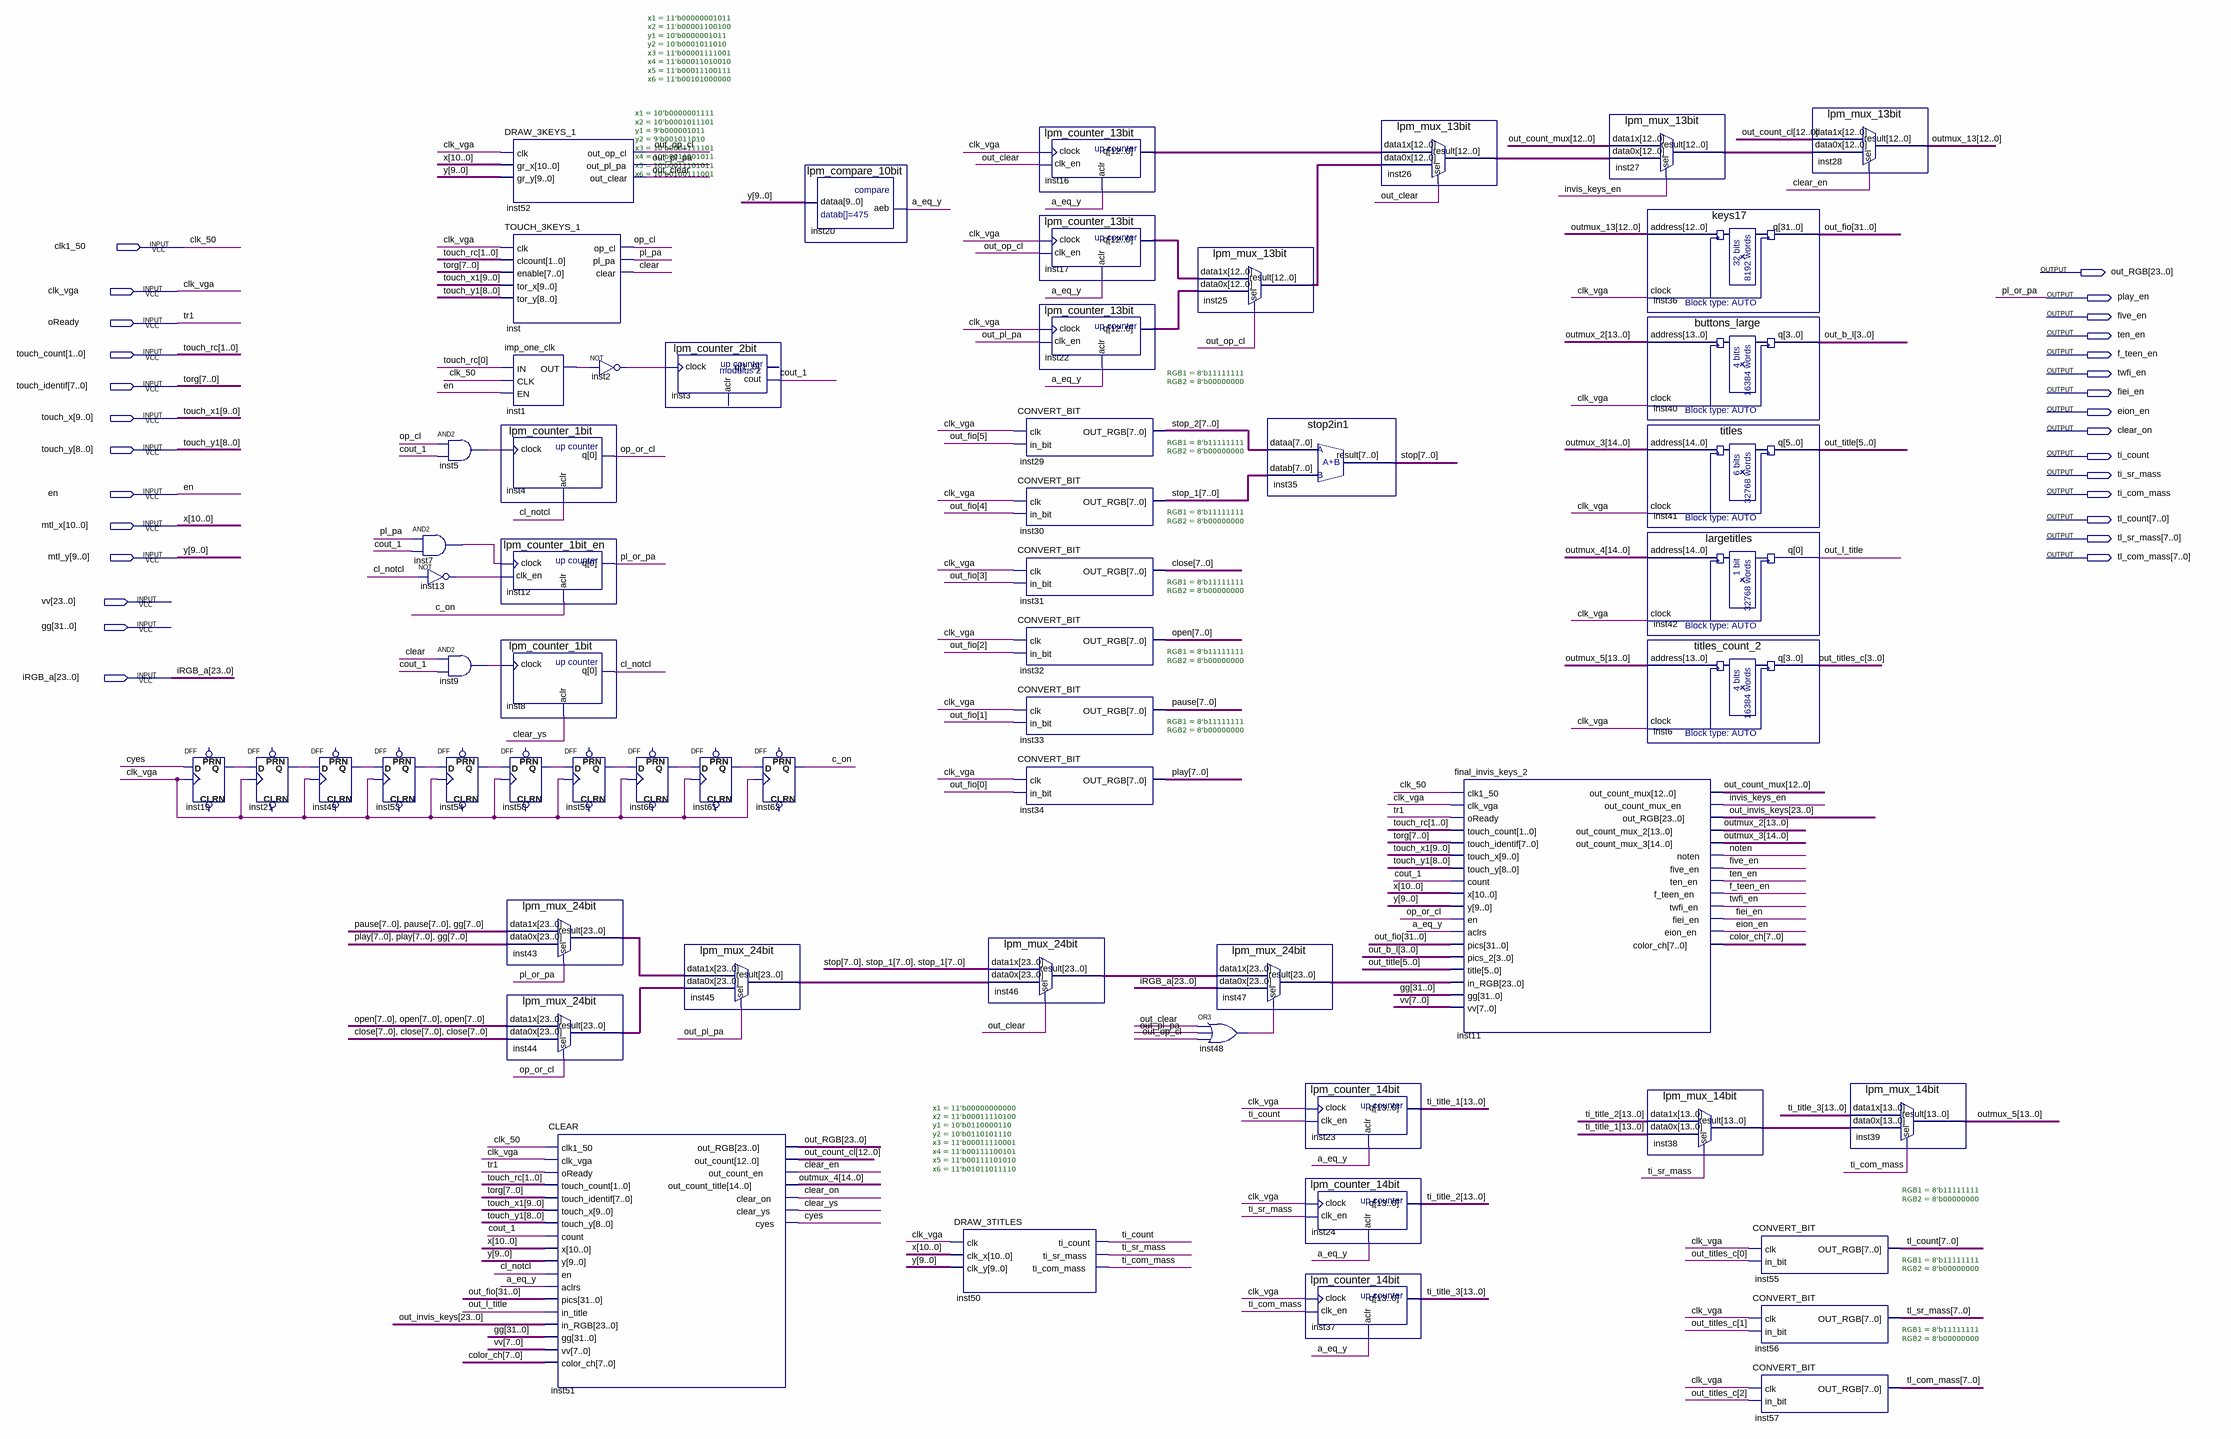
[diagram p0: schematic sheet]
// Quartus schematic final_keys_2.bdf as structural Verilog: 59 symbols, 28 pins
module final_keys_2 (
  input  clk1_50,
  input  clk_vga,
  input  oReady,
  input  [1:0] touch_count,
  input  [7:0] touch_identif,
  input  [9:0] touch_x,
  input  [8:0] touch_y,
  input  en,
  input  [10:0] mtl_x,
  input  [9:0] mtl_y,
  input  [23:0] vv,
  input  [31:0] gg,
  input  [23:0] iRGB_a,
  output [23:0] out_RGB,
  output play_en,
  output five_en,
  output ten_en,
  output f_teen_en,
  output twfi_en,
  output fiei_en,
  output eion_en,
  output clear_on,
  output ti_count,
  output ti_sr_mass,
  output ti_com_mass,
  output [7:0] tl_count,
  output [7:0] tl_sr_mass,
  output [7:0] tl_com_mass
);

  wire a_eq_y, c_on, cl_notcl, clear, clear_en, clear_ys, cout_1, cyes, inst1_out, inst2_out, inst5_out,
       inst7_out, inst9_out, inst13_out, inst19_q, inst21_q, inst48_out, inst49_q, inst53_q, inst54_q,
       inst58_q, inst59_q, inst60_q, inst61_q, invis_keys_en, noten, op_cl, op_or_cl, out_clear, out_l_title,
       out_op_cl, out_pl_pa, pl_pa;
  wire [3:0] out_b_l, out_titles_c;
  wire [5:0] out_title;
  wire [7:0] close, color_ch, open, pause, play, stop, stop_1, stop_2;
  wire [12:0] inst16_q, inst17_q, inst22_q, inst25_result, inst26_result, inst27_result, out_count_cl,
       out_count_mux, outmux_13;
  wire [13:0] inst38_result, outmux_2, outmux_5, ti_title_1, ti_title_2, ti_title_3;
  wire [14:0] outmux_3, outmux_4;
  wire [23:0] inst43_result, inst44_result, inst45_result, inst46_result, inst47_result, out_invis_keys;
  wire [31:0] out_fio;

  DFF inst19 (.CLK(clk_vga), .D(cyes), .Q(inst19_q));  // open: CLRN, PRN
  DFF inst21 (.CLK(clk_vga), .D(inst19_q), .Q(inst21_q));  // open: CLRN, PRN
  DFF inst49 (.CLK(clk_vga), .D(inst21_q), .Q(inst49_q));  // open: CLRN, PRN
  DFF inst53 (.CLK(clk_vga), .D(inst49_q), .Q(inst53_q));  // open: CLRN, PRN
  and inst7 (inst7_out, pl_pa, cout_1);
  not inst13 (inst13_out, cl_notcl);
  and inst5 (inst5_out, op_cl, cout_1);
  and inst9 (inst9_out, clear, cout_1);
  DFF inst54 (.CLK(clk_vga), .D(inst53_q), .Q(inst54_q));  // open: CLRN, PRN
  DRAW_3KEYS_1 #(.x1(11'b00000001011), .x2(11'b00001100100), .y1(10'b0000001011), .y2(10'b0001011010), .x3(11'b00001111001), .x4(11'b00011010010), .x5(11'b00011100111), .x6(11'b00101000000)) inst52 (
    .clk(clk_vga), .gr_x(mtl_x), .gr_y(mtl_y), .out_op_cl(out_op_cl), .out_pl_pa(out_pl_pa),
    .out_clear(out_clear));
  TOUCH_3KEYS_1 #(.x1(10'b0000001111), .x2(10'b0001011101), .y1(9'b000001011), .y2(9'b001011010), .x3(10'b0001111101), .x4(10'b0011001011), .x5(10'b0011101011), .x6(10'b0100111001)) inst (
    .clk(clk_vga), .clcount(touch_count), .enable(touch_identif), .tor_x(touch_x), .tor_y(touch_y),
    .op_cl(op_cl), .pl_pa(pl_pa), .clear(clear));
  imp_one_clk inst1 (.IN(touch_count[0]), .CLK(clk1_50), .EN(en), .OUT(inst1_out));
  lpm_counter_1bit inst4 (.clock(inst5_out), .aclr(cl_notcl), .q(op_or_cl));
  lpm_counter_1bit_en inst12 (.clock(inst7_out), .clk_en(inst13_out), .aclr(c_on), .q(play_en));
  lpm_counter_1bit inst8 (.clock(inst9_out), .aclr(clear_ys), .q(cl_notcl));
  DFF inst58 (.CLK(clk_vga), .D(inst54_q), .Q(inst58_q));  // open: CLRN, PRN
  lpm_mux_24bit inst43 (
    .data1x({pause, pause, gg[7:0]}), .data0x({play, play, gg[7:0]}), .sel(play_en), .result(inst43_result));
  lpm_mux_24bit inst44 (
    .data1x({open, open, open}), .data0x({close, close, close}), .sel(op_or_cl), .result(inst44_result));
  DFF inst59 (.CLK(clk_vga), .D(inst58_q), .Q(inst59_q));  // open: CLRN, PRN
  CLEAR inst51 (
    .clk1_50(clk1_50), .clk_vga(clk_vga), .oReady(oReady), .touch_count(touch_count),
    .touch_identif(touch_identif), .touch_x(touch_x), .touch_y(touch_y), .count(cout_1), .x(mtl_x),
    .y(mtl_y), .en(cl_notcl), .aclrs(a_eq_y), .pics(out_fio), .in_title(out_l_title),
    .in_RGB(out_invis_keys), .gg(gg), .vv(vv[7:0]), .color_ch(color_ch), .out_RGB(out_RGB),
    .out_count(out_count_cl), .out_count_en(clear_en), .out_count_title(outmux_4), .clear_on(clear_on),
    .clear_ys(clear_ys), .cyes(cyes));
  not inst2 (inst2_out, inst1_out);
  DFF inst60 (.CLK(clk_vga), .D(inst59_q), .Q(inst60_q));  // open: CLRN, PRN
  lpm_counter_2bit inst3 (.clock(inst2_out), .cout(cout_1));  // open: aclr, q
  DFF inst61 (.CLK(clk_vga), .D(inst60_q), .Q(inst61_q));  // open: CLRN, PRN
  lpm_mux_24bit inst45 (.data1x(inst43_result), .data0x(inst44_result), .sel(out_pl_pa), .result(inst45_result));
  DFF inst62 (.CLK(clk_vga), .D(inst61_q), .Q(c_on));  // open: CLRN, PRN
  lpm_compare_10bit inst20 (.dataa(mtl_y), .aeb(a_eq_y));
  DRAW_3TITLES #(.x1(11'b00000000000), .x2(11'b00011110100), .y1(10'b0110000110), .y2(10'b0110101110), .x3(11'b00011110001), .x4(11'b00111100101), .x5(11'b00111101010), .x6(11'b01011011110)) inst50 (
    .clk(clk_vga), .clk_x(mtl_x), .clk_y(mtl_y), .ti_count(ti_count), .ti_sr_mass(ti_sr_mass),
    .ti_com_mass(ti_com_mass));
  CONVERT_BIT #(.RGB1(8'b11111111), .RGB2(8'b00000000)) inst29 (.clk(clk_vga), .in_bit(out_fio[5]), .OUT_RGB(stop_2));
  CONVERT_BIT #(.RGB1(8'b11111111), .RGB2(8'b00000000)) inst30 (.clk(clk_vga), .in_bit(out_fio[4]), .OUT_RGB(stop_1));
  CONVERT_BIT #(.RGB1(8'b11111111), .RGB2(8'b00000000)) inst31 (.clk(clk_vga), .in_bit(out_fio[3]), .OUT_RGB(close));
  CONVERT_BIT #(.RGB1(8'b11111111), .RGB2(8'b00000000)) inst32 (.clk(clk_vga), .in_bit(out_fio[2]), .OUT_RGB(open));
  CONVERT_BIT #(.RGB1(8'b11111111), .RGB2(8'b00000000)) inst33 (.clk(clk_vga), .in_bit(out_fio[1]), .OUT_RGB(pause));
  CONVERT_BIT #(.RGB1(8'b11111111), .RGB2(8'b00000000)) inst34 (.clk(clk_vga), .in_bit(out_fio[0]), .OUT_RGB(play));
  lpm_mux_24bit inst46 (
    .data1x({stop, stop_1, stop_1}), .data0x(inst45_result), .sel(out_clear), .result(inst46_result));
  lpm_counter_13bit inst16 (.clock(clk_vga), .clk_en(out_clear), .aclr(a_eq_y), .q(inst16_q));
  lpm_counter_13bit inst17 (.clock(clk_vga), .clk_en(out_op_cl), .aclr(a_eq_y), .q(inst17_q));
  lpm_counter_13bit inst22 (.clock(clk_vga), .clk_en(out_pl_pa), .aclr(a_eq_y), .q(inst22_q));
  lpm_mux_13bit inst25 (.data1x(inst17_q), .data0x(inst22_q), .sel(out_op_cl), .result(inst25_result));
  lpm_mux_24bit inst47 (.data1x(inst46_result), .data0x(iRGB_a), .sel(inst48_out), .result(inst47_result));
  or inst48 (inst48_out, out_clear, out_pl_pa, out_op_cl);
  stop2in1 inst35 (.dataa(stop_2), .datab(stop_1), .result(stop));
  lpm_counter_14bit inst23 (.clock(clk_vga), .clk_en(ti_count), .aclr(a_eq_y), .q(ti_title_1));
  lpm_counter_14bit inst24 (.clock(clk_vga), .clk_en(ti_sr_mass), .aclr(a_eq_y), .q(ti_title_2));
  lpm_counter_14bit inst37 (.clock(clk_vga), .clk_en(ti_com_mass), .aclr(a_eq_y), .q(ti_title_3));
  lpm_mux_13bit inst26 (.data1x(inst16_q), .data0x(inst25_result), .sel(out_clear), .result(inst26_result));
  final_invis_keys_2 inst11 (
    .clk1_50(clk1_50), .clk_vga(clk_vga), .oReady(oReady), .touch_count(touch_count),
    .touch_identif(touch_identif), .touch_x(touch_x), .touch_y(touch_y), .count(cout_1), .x(mtl_x),
    .y(mtl_y), .en(op_or_cl), .aclrs(a_eq_y), .pics(out_fio), .pics_2(out_b_l), .title(out_title),
    .in_RGB(inst47_result), .gg(gg), .vv(vv[7:0]), .out_count_mux(out_count_mux),
    .out_count_mux_en(invis_keys_en), .out_RGB(out_invis_keys), .out_count_mux_2(outmux_2),
    .out_count_mux_3(outmux_3), .noten(noten), .five_en(five_en), .ten_en(ten_en), .f_teen_en(f_teen_en),
    .twfi_en(twfi_en), .fiei_en(fiei_en), .eion_en(eion_en), .color_ch(color_ch));
  lpm_mux_13bit inst27 (.data1x(out_count_mux), .data0x(inst26_result), .sel(invis_keys_en), .result(inst27_result));
  keys17 inst36 (.address(outmux_13), .clock(clk_vga), .q(out_fio));
  buttons_large inst40 (.address(outmux_2), .clock(clk_vga), .q(out_b_l));
  titles inst41 (.address(outmux_3), .clock(clk_vga), .q(out_title));
  largetitles inst42 (.address(outmux_4), .clock(clk_vga), .q(out_l_title));
  titles_count_2 inst6 (.address(outmux_5), .clock(clk_vga), .q(out_titles_c));
  lpm_mux_14bit inst38 (.data1x(ti_title_2), .data0x(ti_title_1), .sel(ti_sr_mass), .result(inst38_result));
  CONVERT_BIT #(.RGB1(8'b11111111), .RGB2(8'b00000000)) inst55 (
    .clk(clk_vga), .in_bit(out_titles_c[0]), .OUT_RGB(tl_count));
  CONVERT_BIT #(.RGB1(8'b11111111), .RGB2(8'b00000000)) inst56 (
    .clk(clk_vga), .in_bit(out_titles_c[1]), .OUT_RGB(tl_sr_mass));
  CONVERT_BIT #(.RGB1(8'b11111111), .RGB2(8'b00000000)) inst57 (
    .clk(clk_vga), .in_bit(out_titles_c[2]), .OUT_RGB(tl_com_mass));
  lpm_mux_13bit inst28 (.data1x(out_count_cl), .data0x(inst27_result), .sel(clear_en), .result(outmux_13));
  lpm_mux_14bit inst39 (.data1x(ti_title_3), .data0x(inst38_result), .sel(ti_com_mass), .result(outmux_5));

  // Other names for the same wires on the sheet: clk_50 = clk1_50; pl_or_pa = play_en; torg[7:0] = touch_identif;
  //   touch_rc[1:0] = touch_count; touch_x1[9:0] = touch_x; touch_y1[8:0] = touch_y; tr1 = oReady; x[10:0] = mtl_x;
  //   y[9:0] = mtl_y
endmodule
